# Altium schematic sheet Relay_baias.SchDoc
size A; SheetNumber: 6; SheetTotal: 6
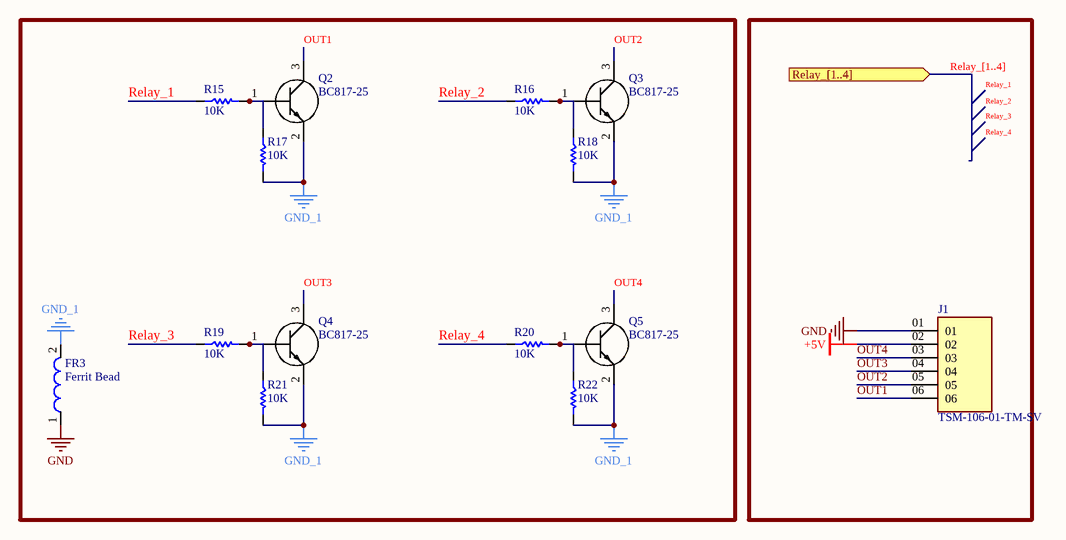
[diagram p0: Relay_baias.SchDoc]

## Parts
FR3  Ferrit Bead  [RES 0805 (2012X06L)]
J1  TSM-106-01-TM-SV  [SAMTEC_TSM-106-01-TM-SV]
Q2  BC817-25  [BC81725215]
Q3  BC817-25  [BC81725215]
Q4  BC817-25  [BC81725215]
Q5  BC817-25  [BC81725215]
R15  10K  [RES 0603 (1608X06L)]
R16  10K  [RES 0603 (1608X06L)]
R17  10K  [RES 0603 (1608X06L)]
R18  10K  [RES 0603 (1608X06L)]
R19  10K  [RES 0603 (1608X06L)]
R20  10K  [RES 0603 (1608X06L)]
R21  10K  [RES 0603 (1608X06L)]
R22  10K  [RES 0603 (1608X06L)]

## Ports
Relay_[1..4] (in)

## Nets
+5V: J1.02
GND: FR3.1 J1.01
GND_1: FR3.2 Q2.2(E) Q3.2(E) Q4.2(E) Q5.2(E) R17.2 R18.2 R21.2 R22.2
OUT1: J1.06 Q2.3(C)
OUT2: J1.05 Q3.3(C)
OUT3: J1.04 Q4.3(C)
OUT4: J1.03 Q5.3(C)
Relay_1: R15.1
Relay_2: R16.1
Relay_3: R19.1
Relay_4: R20.1
NetQ2_1: Q2.1(B) R15.2 R17.1
NetQ3_1: Q3.1(B) R16.2 R18.1
NetQ4_1: Q4.1(B) R19.2 R21.1
NetQ5_1: Q5.1(B) R20.2 R22.1

## Buses and harness runs
bus Relay_[1..4] = port Relay_[1..4]

## Notes on the sheet
- Labels drawn without touching a wire or pin: Relay_1, Relay_2, Relay_3, Relay_4

## Library data of the parts
J1 = TSM-106-01-TM-SV: CONN HEADER SMD 6POS 2.54MM; MF: Samtec; SnapEDA_Link: https://www.snapeda.com/parts/TSM-106-01-TM-SV/Samtec/view-part/3383178/?ref=snap; Check_prices: https://www.snapeda.com/parts/TSM-106-01-TM-SV/Samtec/view-part/3383178/?ref=eda; Availability: Bad; Value: *; Price: None; MP: TSM-106-01-TM-SV; Package: None; Purchase-URL: https://pricing.snapeda.com/search/part/TSM-106-01-TM-SV/?ref=eda
Q2-Q5 = BC817-25: Transistor BJT NPN; Manufacturer_Name: Nexperia; Datasheet Link: https://assets.nexperia.com/documents/data-sheet/BC817_BC817W_BC337.pdf; Height: 1.1mm; Manufacturer_Part_Number: BC817-25; Mouser Part Number: N/A; Mouser Price/Stock: https://www.mouser.com/Search/Refine.aspx?Keyword=N%2FA
R15-R22 = Resistor: Tolerance: 5%; Power: 1/8 W; Value: 10K